# Altium project Driver Input Sensor.PrjPcb
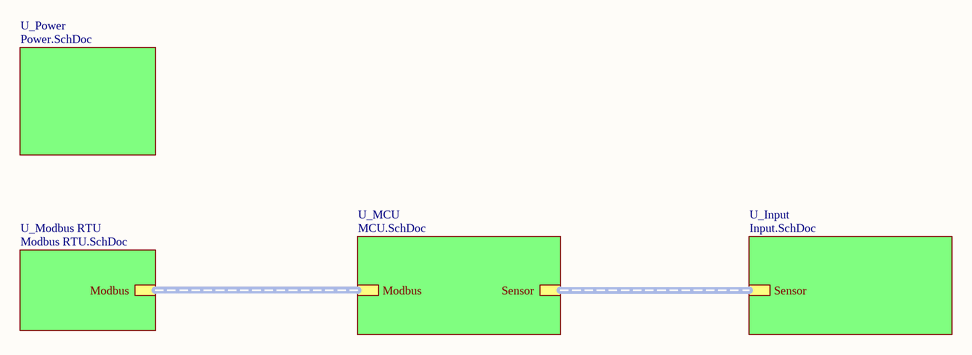
[diagram p0: Diagram.SchDoc]
6 sheets, 98 parts. Net scope: hierarchical (ports join the sheet entries above them; power ports are global).
Board file: Diver Sensor.PcbDoc
Sheets:
  Diagram.SchDoc
    U_Power = Power.SchDoc
    U_Modbus RTU = Modbus RTU.SchDoc
    U_MCU = MCU.SchDoc
    U_Input = Input.SchDoc
      U_Input_Sensor E3J-DS30M2 = Input_Sensor E3J-DS30M2.SchDoc
      U_Input_Sensor E3J-DS30M3 = Input_Sensor E3J-DS30M2.SchDoc
      U_Input_Sensor E3J-DS30M4 = Input_Sensor E3J-DS30M2.SchDoc

## Sheet Diagram.SchDoc
size A4; SheetNumber: 1; SheetTotal: 6

### Sub-sheets
U_Input = Input.SchDoc: Sensor (harness Sensor)
U_MCU = MCU.SchDoc: Modbus (harness Modbus), Sensor (harness Sensor)
U_Modbus RTU = Modbus RTU.SchDoc: Modbus (harness Modbus)
U_Power = Power.SchDoc: no entries

### Buses and harness runs
harness sheet U_Input/Sensor = sheet U_MCU/Sensor
harness sheet U_MCU/Modbus = sheet U_Modbus RTU/Modbus

### Notes on the sheet
- Title
- Size:
- Date:
- A3
- Number:
- Time:
- Revision:
- Sheet
- of
- NICHIETSUVN.COM <http://NICHIETSUVN.COM>
- R&D
- File:

## Sheet Power.SchDoc
size A4; SheetNumber: 2; SheetTotal: 6
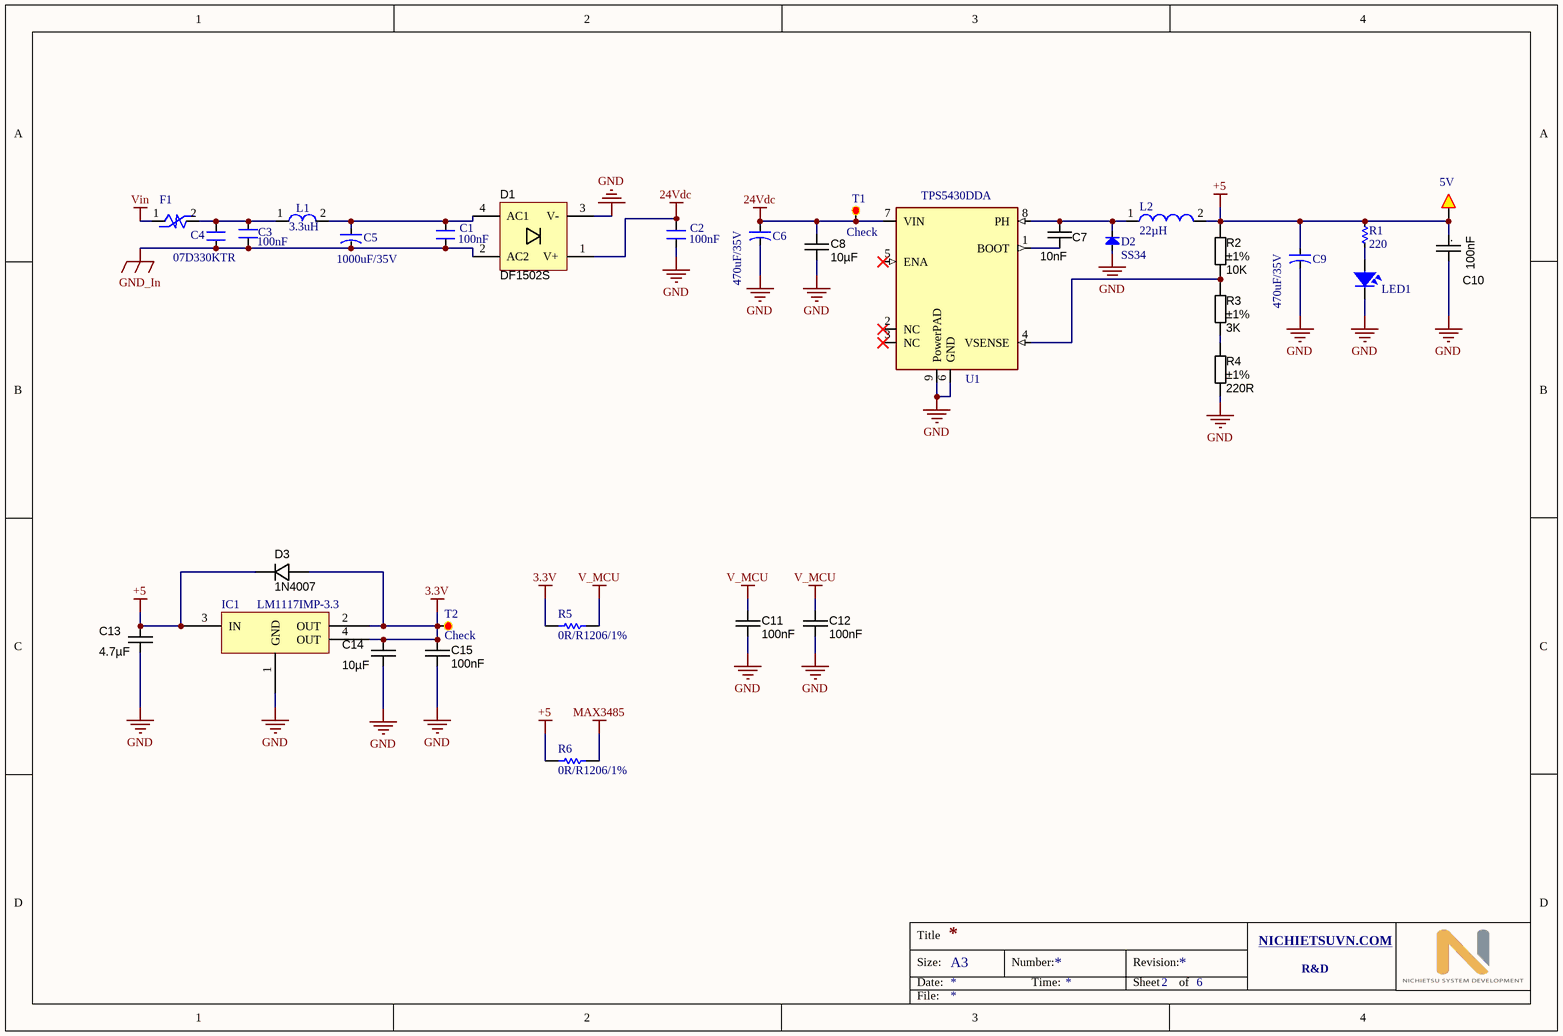
[diagram p1: Power.SchDoc]

### Parts
C1  100nF  [CN-SMD-1206]
C2  100nF  [CN-SMD-1206]
C3  100nF  [CN2.5]
C4  07D330KTR  [CN2-T]
C5  1000uF/35V  [CA-ALU-5L]
C6  470uF/35V  [CA-ALU-6.3]
C7  10nF  [CAPC1608X90N]
C8  10µF  [CAPC2012X135N]
C9  470uF/35V  [CA-ALU-6.3]
C10  100nF  [CAPC2012X135N]
C11  100nF  [CAPC1608X90N]
C12  100nF  [CAPC1608X90N]
C13  4.7µF  [CAPC2012X135N]
C14  10µF  [CAPC2012X135N]
C15  100nF  [CAPC1608X90N]
Check1  5V  [SMD-2]
D1  DF1502S  [DIODE_DF_S]
D2  SS34  [DIO-SMD-106]
D3  1N4007  [DO-214AC]
F1  RUEF185  [RUEF165]  (value not drawn)
IC1  LM1117IMP-3.3  [SOT223]
L1  3.3uH  [L-SMD-M-7.3x4.5]
L2  22µH  [IND_COIL_8D43]
LED1  LED  [LED-0805-Blue]  (value not drawn)
R1  220  [RES-SMD-0603]
R2  value 10K  Tolerance: ±1%  [RESC1608X55N]  (hidden comment: 10K_0603_1%)
R3  value 3K  Tolerance: ±1%  [RESC1608X55N]  (hidden comment: 3K_0603_0.5%)
R4  value 220R  Tolerance: ±1%  [RESC1608X55N]  (hidden comment: 220R_0603_1%)
R5  0R/R1206/1%  [R1206]
R6  0R/R1206/1%  [R1206]
T1  Check  [SMD_1.5]
T2  Check  [SMD_1.5]
U1  TPS5430DDA  [TPS5430]

### Nets
3.3V: C14.2 C15.1 D3.A IC1.2(OUT) IC1.4(OUT) R5.1 T2.1
24Vdc: C2.2 C6.1 C8.2 D1.1(V+) T1.1 U1.7(VIN)
+5: C9.1 C10.1 C13.2 Check1.1 D3.C IC1.3(IN) L2.2 R1.1 R2.2 R6.1
GND: C2.1 C6.2 C8.1 C9.2 C10.2 C11.2 C12.2 C13.1 C14.1 C15.2 D1.3(V-) D2.1(A) IC1.1(GND) LED1.2 R4.1 U1.6(GND) U1.9(PowerPAD)
GND_In: C1.1 C3.1 C4.1 C5.2 D1.2(AC2)
MAX3485: R6.2
V_MCU: C11.1 C12.1 R5.2
Vin: F1.1
NetC1_2: C1.2 C5.1 D1.4(AC1) L1.2
NetC3_2: C3.2 C4.2 F1.2 L1.1
NetC7_1: C7.1 U1.1(BOOT)
NetC7_2: C7.2 D2.2(K) L2.1 U1.8(PH)
NetLED1_1: LED1.1 R1.2
NetR2_1: R2.1 R3.2 U1.4(VSENSE)
NetR3_1: R3.1 R4.2

Not connected (* = marked no-connect by the designer): U1 2(NC)* 3(NC)* 5(ENA)*

### Notes on the sheet
- Title
- Size:
- Date:
- A3
- Number:
- Time:
- Revision:
- Sheet
- of
- NICHIETSUVN.COM <http://NICHIETSUVN.COM>
- R&D
- File:
- (in symbol CAPC_100nF_0805_X7R_50V_10%) .

### Library data of the parts
C1-C4 = CN: Value: 33pF
C5 C6 C9 = CN-ALU-DIP: Capacitor (Semiconductor SIM Model); Value: 104; LatestRevisionDate: 17-Jul-2002; LatestRevisionNote: Re-released for DXP Platform.; PackageReference: C1206; Publisher: Altium Limited
C7 = CAPC_10000pF_0603_50V_10%: 10000pF ±10% 50V Ceramic Capacitor X7R 0603 (1608 Metric); Manufacturer 1: TDK Corporation; Manufacturer Part Number 1: CGA3E2X7R1H103K080AA; Pcs 2: 10; Tolerance: ±10%; Operating Temperature: -55°C ~ 125°C; Package / Case: 0603 (1608 Metric); Voltage - Rated: 50V; Ratings: AEC-Q200; Temperature Coefficient: X7R; Supplier Part Number 1: 445-5662-6-ND; Supplier 1: Digi-Key; Supplier 2: https://www.thegioiic.com; Supplier Part Number 2: https://www.thegioiic.com/products/tu-gom-0603-10nf-50v; Price 2: 1900; Value: 10nF
C8 = CAPC_10uF_0805_X7R_25V_10%: 10µF ±10% 50V Ceramic Capacitor X7R 1206 (3216 Metric); Manufacturer 1: Taiyo Yuden; Manufacturer Part Number: TMK316AB7106KLHT; Voltage - Rated: 25V; Pcs 2: 10; Supplier 1: Digi-Key; Supplier Part Number 1: 587-3485-6-ND; Tolerance: ±10%; Operating Temperature: -55°C ~ 125°C; Package / Case: 0805 (2012 metric); Ratings: AEC-Q200; Temperature Coefficient: X7R; Supplier 2: https://www.thegioiic.com; Supplier Part Number 2: https://www.thegioiic.com/products/tu-gom-0805-10uf-25v; Price 2: 5800; Value: 10µF
C10 = CAPC_100nF_0805_X7R_50V_10%: 0.1µF ±10% 50V Ceramic Capacitor X7R 0805 (2012 Metric); Manufacturer 1: Samsung Electro-Mechanics; Manufacturer Part Number: CL21B104KBFXPJE; Pcs 2: 10; Supplier 1: Digi-Key; Supplier Part Number 1: 1276-CL21B104KBFXPJEDKR-ND; Tolerance: ±10%; Operating Temperature: -55°C ~ 125°C; Package / Case: 0805 (2012 metric); Voltage - Rated: 50V; Ratings: AEC-Q200; Temperature Coefficient: X7R; Price 2: 2000; Supplier 2: https://www.thegioiic.com; Supplier Part Number 2: https://www.thegioiic.com/products/tu-gom-0805-100nf-0-1uf-50v; Value: 100nF
C11 C12 C15 = CAPC_100nF_0603_X7R_50V_10%: 0.1µF ±10% 50V Ceramic Capacitor X7R 0603 (1608 Metric); Manufacturer 1: TDK Corporation; Manufacturer Part Number 1: CGA3E2X7R1H104K080AA; Pcs 2: 10; Supplier 1: Digi-Key; Supplier Part Number 1: 445-5666-6-ND; Tolerance: ±10%; Operating Temperature: -55°C ~ 125°C; Package / Case: 0603 (1608 Metric); Voltage - Rated: 50V; Ratings: AEC-Q200; Temperature Coefficient: X7R; Applications: Automotive; Packaging: Digi-Reel®; Supplier 2: www.thegioiic.com; Supplier Part Number 2: https://www.thegioiic.com/products/tu-gom-0603-100nf-0-1uf-50v; Price 2: 1800; Value: 100nF
C13 C14 = CAPC_4.7uF_0805_X7R_50V_10%: 4.7µF ±10% 50V Ceramic Capacitor X7R 0805 (2012 Metric); Manufacturer 1: TDK Corporation; Manufacturer Part Number: CGA4J1X7R1H475K125AE; Pcs 2: 1; Package / Case: 0805 (2012 metric); Tolerance: ±10%; Voltage - Rated: 50V; Temperature Coefficient: X7R; Ratings: AEC-Q200; Operating Temperature: -55°C ~ 125°C; Supplier 1: Digi-Key; Supplier Part Number 1: 445-181410-6-ND; Supplier 2: https://www.thegioiic.com; Supplier Part Number 2: https://www.thegioiic.com/products/tu-gom-0805-4-7uf-50v; Price 2: 680
  C13: Value: 4.7µF
  C14: Value: 10µF
Check1 T1 T2 = Test: WR-PHD 2.54 mm Angled Socket Header; Manufacturer: W¨¹rth Elektronik eiSos GmbH; partNo: 613002143121; ComponentLink1 Description: Manufacturer; ComponentLink2 Description: Datasheet; NoPins: 02; Created Date: 29 March 2013; ComponentLink1URL: http://www.we-online.com; ComponentLink2URL: http://katalog.we-online.de/em/datasheet/6130xx143121.pdf; Created by: Karrer Zheng
D1 = DIODE_DF1502S: Bridge Rectifier Single Phase Standard 200V Surface Mount DF-S; Manufacturer 1: Diodes Incorporated; Manufacturer Part Number 1: DF1502S-T; Ratings: 200V; 1.5A; Pcs 2: 1; Package / Case: 4-SMD, Gull Wing; Diode Type: Standard; Mounting Type: Surface Mount; Supplier 1: Digi-Key; Supplier Part Number 1: DF1502SDIDKR-ND; Supplier 2: https://www.thegioiic.com; Supplier Part Number 2: https://www.thegioiic.com/products/df1502s-cau-chinh-luu-200v-1-5a; Price 2: 3500
D2 = Diode SMD: Default Diode; Code - JEDEC: DO-214-AB; Value: 1N5007; Published: 8-Jun-2000; Revision: July-2002: Re-released for DXP Platform.; Publisher: Altium Limited
D3 = DIODE_1N4007: Diode  Standard Rectifier SMD 1000V 1A SMA; Manufacturer 1: Micro Commercial Co; Manufacturer Part Number 1: SM4007PL-TP; Speed: Standard Recovery >500ns, > 200mA (Io); Ratings: 1000V; 1A; Pcs 2: 1; Package / Case: DO-214AC, SMA; Diode Type: Standard; Mounting Type: Surface Mount; Supplier 1: Digi-Key; Supplier Part Number 1: SM4007PL-TPMSDKR-ND; Supplier 2: https://www.thegioiic.com; Supplier Part Number 2: https://www.thegioiic.com/products/1n4007-m7-diode-chinh-luu-1a-1kv; Price 2: 1000
IC1 = IC_LM1117IMP-3.3: Linear Voltage Regulator IC  1 Output  800mA SOT-223; Manufacturer: Texas Instruments; Manufacturer Part Number: LM1117IMP-3.3/NOPB; Voltage - Input (Max): 15V; Voltage Dropout (Max): 1.2V @ 800mA; Protection Features: Over Current, Over Temperature; PSRR: 75dB (120Hz); Pcs 2: 1; Supplier 1: Digi-Key; Supplier Part Number 1: LM1117IMP-3.3/NOPBDKR-ND; Current - Output: 800mA; Operating Temperature: -40°C ~ 125°C; Price 2: 11000; Supplier Device Package: SOT-223; Supplier 2: https://www.thegioiic.com; Supplier Part Number 2: https://www.thegioiic.com/products/lm1117imp-3-3-nopb-ic-on-ap-3-3v-800ma
L1 = L-SMD-1: partNo: 78477010; Manufacturer: Wurth Elektronik; Inductance: 1.0 μH; ComponentLink1Description: Manufacturer; ComponentLink1URL: http://www.we-online.de; Created by: Baojun Chen; Created Date: Nov.2015; ComponentLink2Description: Datasheet; ComponentLink2URL: http://katalog.we-online.de/pbs/datasheet/78477010.pdf
L2 = INDC_SMD_22uH_8D43: 22µH Shielded Wirewound Inductor 950mA 380mOhm Max Nonstandard; Manufacturer 1: Yageo; Current Rating (Amps): 3.25 A; Ratings: None AEC-Q200; Pcs 2: 1; Supplier 1: Digi-Key; Operating Temperature: -40°C ~ 125°C; Value: 22µH; Supplier 2: https://www.thegioiic.com/; Supplier Part Number 2: https://www.thegioiic.com/products/cuon-cam-dan-smd-8d43-220-22uh-3-25a; Price 2: 2000
LED1 = LED SMD: Value: LED 3 - 5 ly 2 Colour
R1 = Res-SMD: Resistor; Manufacturer: Generic Components; Class: Passive; Published: 08/06/2000; Publisher: Altium Hobart Technology Centre
R2 = RES_10K_0603_1%: 10 kOhms ±1% 0.1W, 1/10W Chip Resistor 0603 (1608 Metric) Anti-Sulfur, Automotive AEC-Q200, Moisture Resistant Thin Film; Manufacturer: Stackpole Electronics Inc; Manufacturer Part Number: RMCF0603FT10K0; Temperature Coefficient: ±100ppm/°C; Pcs 2: 50; Package / Case: 0603 (1608 Metric); Power (Watts): 1/10W; Supplier 1: Digi-Key; Supplier Part Number 1: RMCF0603FT10K0DKR-ND; Ratings: Automotive AEC-Q200; Operating Temperature: -55°C ~ 155°C; Supplier 2: www.thegioiic.com; Supplier Part Number 2: https://www.thegioiic.com/products/dien-tro-10-kohm-0603-1; Price 2: 2000
R3 = RES_3K_0603_1%: 3 kOhms ±1% 0.1W, 1/10W Chip Resistor 0603 (1608 Metric) Automotive AEC-Q200 Thick Film; Manufacturer: Stackpole Electronics Inc; Manufacturer Part Number: RMCF0603FT3K00; Temperature Coefficient: ±100ppm/°C; Pcs 2: 50; Package / Case: 0603 (1608 Metric); Power (Watts): 1/10W; Supplier 1: Digi-Key; Supplier Part Number 1: RMCF0603FT3K00DKR-ND; Ratings: AEC-Q200; Supplier Part Number 2: https://www.thegioiic.com/products/dien-tro-3-kohm-0603-1; Supplier 2: www.thegioiic.com; Operating Temperature: -55°C ~ 155°C; Price 2: 2000
R4 = RES_220R_0603_1%: 220 Ohms ±1% 0.1W, 1/10W Chip Resistor 0603 (1608 Metric) Automotive AEC-Q200 Thick Film; Manufacturer: Stackpole Electronics Inc; Manufacturer Part Number: RMCF0603FT220R; Temperature Coefficient: ±100ppm/°C; Pcs 2: 50; Package / Case: 0603 (1608 Metric); Ratings: AEC-Q200; Supplier 1: Digi-Key; Supplier Part Number 1: RMCF0603FT220RDKR-ND; Power (Watts): 0.1W, 1/10W; Operating Temperature: -55°C ~ 155°C; Composition: Thick Film; Supplier 2: www.thegioiic.com; Supplier Part Number 2: https://www.thegioiic.com/products/dien-tro-220-ohm-0603-1; Price 2: 2000
R5 R6 = RES_0R/R1206/1%: RES SMD 0.0 OHM JUMPER 1/4W 1206; Manufacturer: Bourns Inc.; Manufacturer Part Number: CR1206-J/-000ELF; Resistance (Ohms): 0.0; Power (Watts): 0.25W, 1/4W; Temperature Coefficient: -250/ +500ppm/°C; Supplier 1: Digi-Key; RoHS: RoHS Compliant By Exemption; Category: Resistors; Stock 1: 80000; Pricing 1: 5000=0.00931, 10000=0.00809, 25000=0.00711, 50000=0.00652, 125000=0.00638 (USD); Packaging: Tape & Reel (TR); Tolerance: Jumper; Composition: Thick Film; Features: Moisture Resistant; Operating Temperature: -55°C ~ 155°C; Package / Case: 1206 (3216 Metric); Supplier Device Package: 1206; Size / Dimension: 0.126" L x 0.063" W (3.20mm x 1.60mm); Height: 0.030" (0.75mm); Number of Terminations: 2; ComponentLink1URL: http://www.bourns.com/data/global/pdfs/CHPREZTR.pdf; ComponentLink1Description: http://www.bourns.com/data/global/pdfs/CHPREZTR.pdf; Supplier Part Number 1: CR1206-J/-000ELFTR-ND

## Sheet Modbus RTU.SchDoc
size A4; SheetNumber: 6; SheetTotal: 6
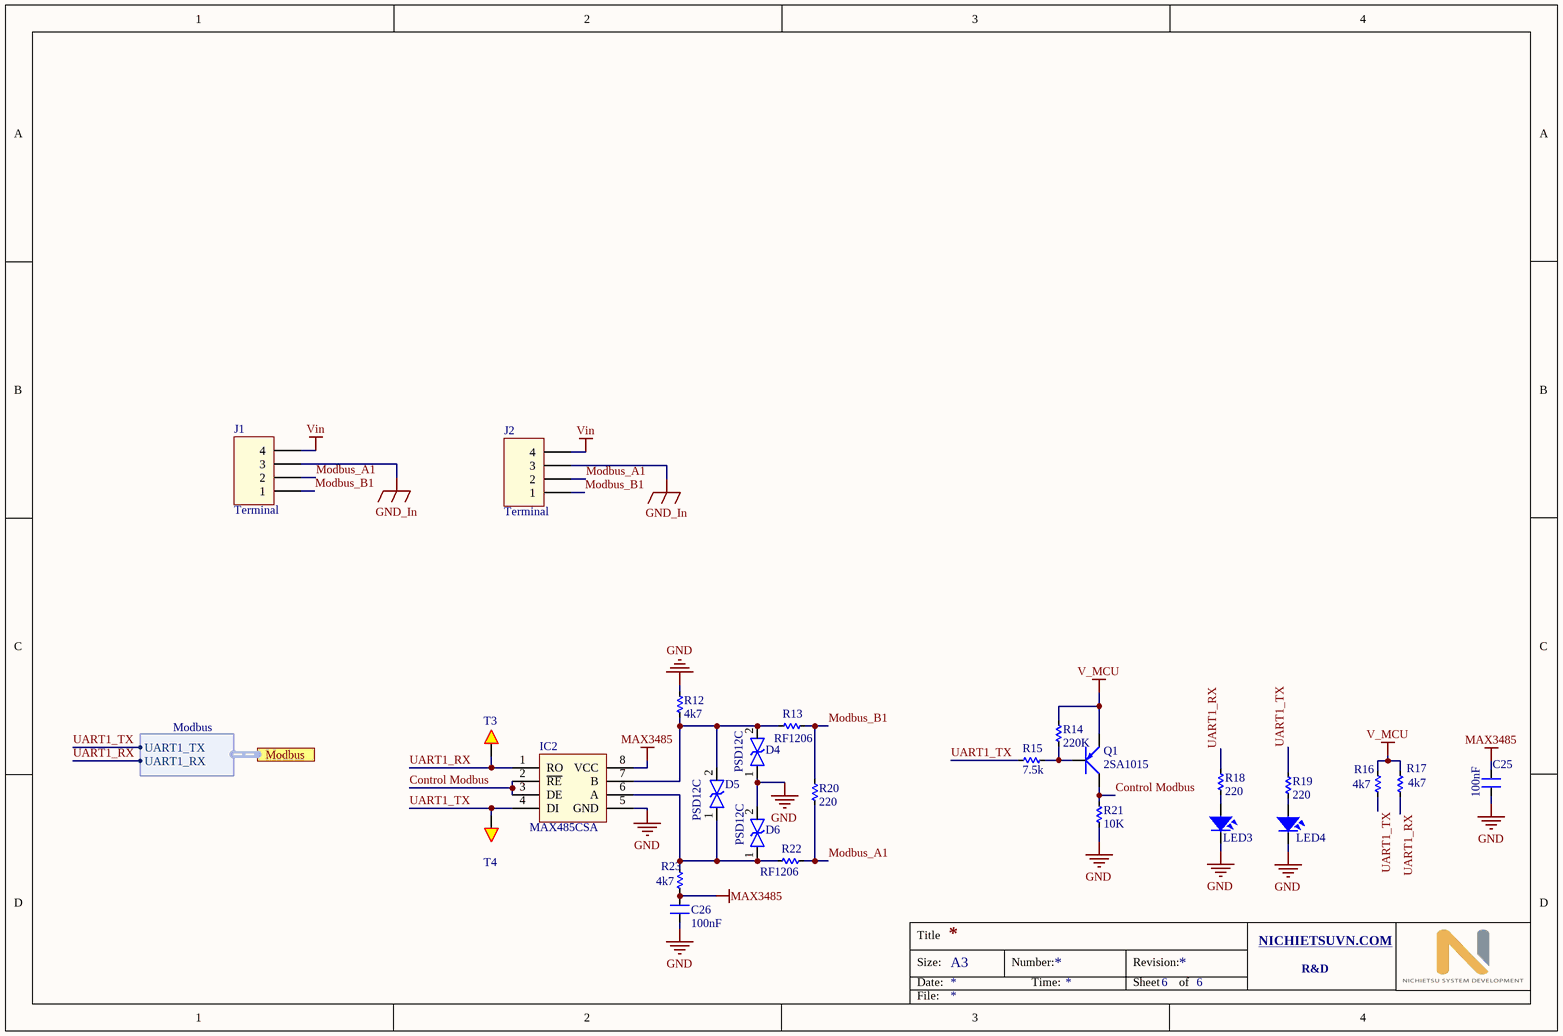
[diagram p2: Modbus RTU.SchDoc]

### Parts
C25  100nF  [CN-SMD-0603]
C26  100nF  [CN-SMD-0603]
D4  PSD12C  [PSD12C]
D5  PSD12C  [PSD12C]
D6  PSD12C  [PSD12C]
IC2  MAX485CSA  [SO8]
J1  Terminal  [691305340004]
J2  Terminal  [691305340004]
LED3  LED  [LED-0805-Blue]  (value not drawn)
LED4  LED  [LED-0805-Blue]  (value not drawn)
Q1  2SA1015  [SOT23-321]
R12  4k7  [RES-SMD-0603]
R13  RF1206  [RES-SMD-1206]
R14  220K  [RES-SMD-0603]
R15  7.5k  [RES-SMD-0603]
R16  4k7  [RES-SMD-0603]
R17  4k7  [RES-SMD-0603]
R18  220  [RES-SMD-0603]
R19  220  [RES-SMD-0603]
R20  220  [RES-SMD-0603]
R21  10K  [RES-SMD-0603]
R22  RF1206  [RES-SMD-1206]
R23  4k7  [RES-SMD-0603]
T3  Test  [Test]  (value not drawn)
T4  Test  [Test]  (value not drawn)

### Ports
Modbus (harness Modbus)

### Harnesses
Modbus: UART1_TX, UART1_RX

### Nets
GND: C25.1 C26.2 D4.1 D6.2 IC2.5(GND) LED3.2 LED4.2 R12.1 R21.1
GND_In: J1.3 J2.3
MAX3485: C25.2 C26.1 IC2.8(VCC) R23.1
V_MCU: Q1.1(E) R14.2 R16.1 R17.1
Vin: J1.4 J2.4
Control Modbus: IC2.2(~{RE}) IC2.3(DE) Q1.2(C) R21.2
Modbus_A1: J1.2 J2.2 R20.2 R22.1
Modbus_B1: J1.1 J2.1 R13.1 R20.1
UART1_RX: IC2.1(RO) R17.2 R18.1 T3.1 ; port Modbus.UART1_RX
UART1_TX: IC2.4(DI) R15.1 R16.2 R19.1 T4.1 ; port Modbus.UART1_TX
NetD4_2: D4.2 D5.2 IC2.7(B) R12.2 R13.2
NetD5_1: D5.1 D6.1 IC2.6(A) R22.2 R23.2
NetLED3_1: LED3.1 R18.2
NetLED4_1: LED4.1 R19.2
NetQ1_3: Q1.3(B) R14.1 R15.2

### Notes on the sheet
- Title
- Size:
- Date:
- A3
- Number:
- Time:
- Revision:
- Sheet
- of
- NICHIETSUVN.COM <http://NICHIETSUVN.COM>
- R&D
- File:

### Library data of the parts
C25 C26 = CN: Value: 33pF
D4-D6 = PSD12C: diode tvs
IC2 = MAX485: RS232 - RS485 (Same sn75176)
J1 J2 = 691305340004: WR-TBL Serie 3053 - 3.81 mm Horizontal PCB Header with Plastic Latch, 04p; Pitch: 3.81 mm; Published Date: Jan 2017; Publisher: Wurth Elektronik; ComponentLink1Description: Manufacturer; ComponentLink1URL: http://www.we-online.de; ComponentLink2Description: Datasheet; ComponentLink2URL: http://katalog.we-online.de/em/datasheet/691305340004.pdf; Part Number: 691305340004; Pin Number: 04p
LED3 LED4 = LED SMD: Value: LED 3 - 5 ly 2 Colour
Q1 = 2SA1015: PNP 600mW, ECB; Value: A1015
R12-R23 = Res-SMD: as R1 on sheet Power; Published: 08/06/2000; Publisher: Altium Hobart Technology Centre
T3 T4 = Test: as Check1 on sheet Power; Created Date: 29 March 2013; ComponentLink1URL: http://www.we-online.com; ComponentLink2URL: http://katalog.we-online.de/em/datasheet/6130xx143121.pdf; Created by: Karrer Zheng

## Sheet MCU.SchDoc
size A4; SheetNumber: 5; SheetTotal: 6
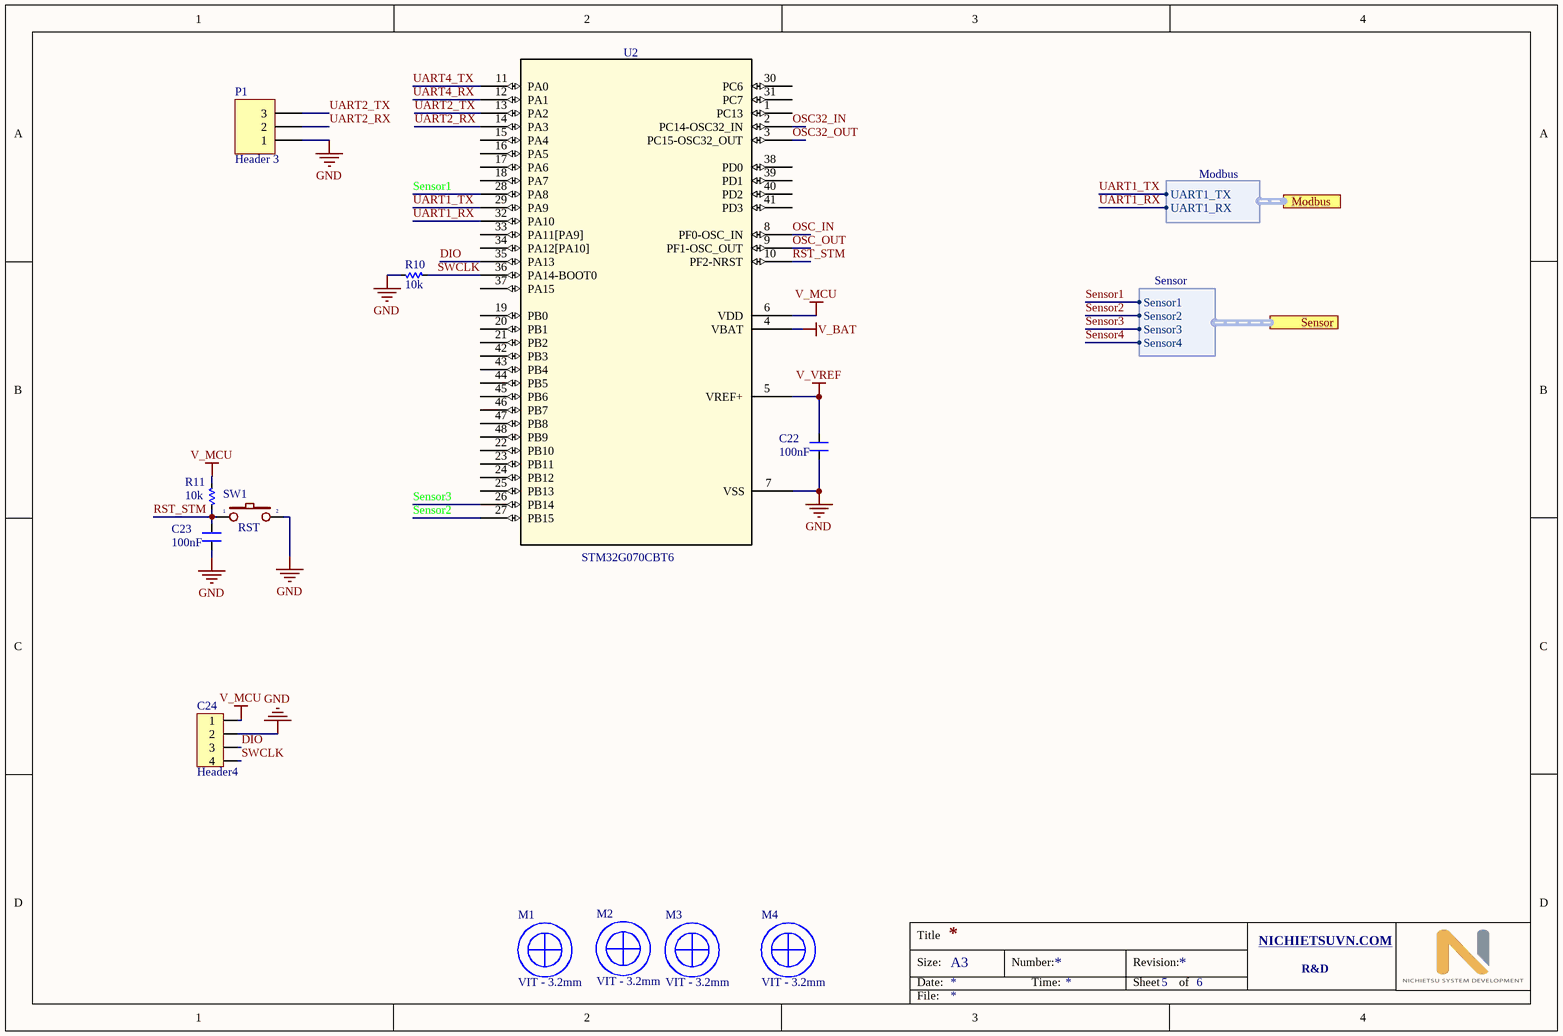
[diagram p3: MCU.SchDoc]

### Parts
C22  100nF  [CN-SMD-0603]
C23  100nF  [CN-SMD-0603]
C24  Header4  [Header4]
M1  VIT - 3.2mm  [VIT - 3.2MM_2]
M2  VIT - 3.2mm  [VIT - 3.2MM_2]
M3  VIT - 3.2mm  [VIT - 3.2MM_2]
M4  VIT - 3.2mm  [VIT - 3.2MM_2]
P1  Header 3  [Header 3]
R10  10k  [RES-SMD-0603]
R11  10k  [RES-SMD-0603]
SW1  RST  [SW1-SMD]
U2  STM32G070CBT6  [STM32G070CBT6]

### Ports
Modbus (harness Modbus), Sensor (harness Sensor)

### Harnesses
Modbus: UART1_TX, UART1_RX
Sensor: Sensor1, Sensor2, Sensor3, Sensor4

### Nets
GND: C22.2 C23.2 C24.2 P1.1 R10.2 SW1.2 U2.7(VSS)
V_BAT: U2.4(VBAT)
V_MCU: C24.1 R11.1 U2.6(VDD)
V_VREF: C22.1 U2.5(VREF+)
DIO: C24.3 U2.35(PA13)
OSC32_IN: U2.2(PC14-OSC32_IN)
OSC32_OUT: U2.3(PC15-OSC32_OUT)
OSC_IN: U2.8(PF0-OSC_IN)
OSC_OUT: U2.9(PF1-OSC_OUT)
RST_STM: C23.1 R11.2 SW1.1 U2.10(PF2-NRST)
Sensor1: U2.28(PA8) ; port Sensor.Sensor1  [project net OPTO_OUT]
Sensor2: U2.27(PB15) ; port Sensor.Sensor2  [project net OPTO_OUT]
Sensor3: U2.26(PB14) ; port Sensor.Sensor3  [project net OPTO_OUT]
Sensor4: port Sensor.Sensor4
SWCLK: C24.4 R10.1 U2.36(PA14-BOOT0)
UART1_RX: U2.32(PA10) ; port Modbus.UART1_RX
UART1_TX: U2.29(PA9) ; port Modbus.UART1_TX
UART2_RX: P1.2 U2.14(PA3)
UART2_TX: P1.3 U2.13(PA2)
UART4_RX: U2.12(PA1)
UART4_TX: U2.11(PA0)

Not connected (* = marked no-connect by the designer): U2 1(PC13) 15(PA4) 16(PA5) 17(PA6) 18(PA7) 19(PB0) 20(PB1) 21(PB2) 22(PB10) 23(PB11) 24(PB12) 25(PB13) 30(PC6) 31(PC7) 33(PA11[PA9]) 34(PA12[PA10]) 37(PA15) 38(PD0) 39(PD1) 40(PD2) 41(PD3) 42(PB3) 43(PB4) 44(PB5) 45(PB6) 46(PB7) 47(PB8) 48(PB9)

### Notes on the sheet
- Title
- Size:
- Date:
- A3
- Number:
- Time:
- Revision:
- Sheet
- of
- NICHIETSUVN.COM <http://NICHIETSUVN.COM>
- R&D
- File:

### Library data of the parts
C22 C23 = CN: Value: 33pF
C24 = Header4: Header IDC, 4 x 1 Pin Vertical 2.54mm Pitch (Non-Boxed, Male); Manufacturer: W¨¹rth Elektronik eiSos GmbH; partNo: 613002143121; ComponentLink1 Description: Manufacturer; ComponentLink2 Description: Datasheet; NoPins: 02; Created Date: 29 March 2013; ComponentLink1URL: http://www.we-online.com; ComponentLink2URL: http://katalog.we-online.de/em/datasheet/6130xx143121.pdf; Created by: Karrer Zheng
M1-M4 = VIT - 3.2mm_1
P1 = Header 3: Header, 3-Pin; LatestRevisionDate: 17-Jul-2002; LatestRevisionNote: Re-released for DXP Platform.; Publisher: Altium Limited
R10 R11 = Res-SMD: as R1 on sheet Power; Published: 08/06/2000; Publisher: Altium Hobart Technology Centre
SW1 = SW2: Switch button 2 pin; Value: SW chip 2 pin
U2 = STM32G070CBT6: No Description Available; Vendor: STMicroelectronics; Built_By: EMA_UL_Team; SourceLibrary: Updates_to_database_2020-10-19; Manufacturer_Part_Number: STM32G070CBT6; Copyright: Copyright (C) 2018 Accelerated Designs. All rights reserved; RefDes: RefDes; Type: DEV

## Sheet Input.SchDoc
size A4; SheetNumber: 3; SheetTotal: 6
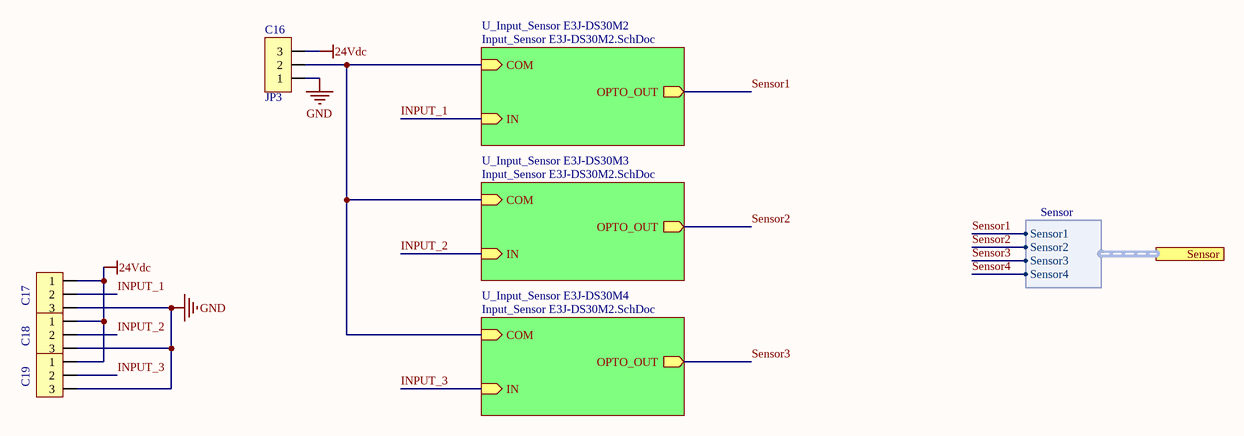
[diagram p4: Input.SchDoc]

### Parts
C16  JP3  [JP3-CLOSED]
C17  Header3  [Header3 90]  (value not drawn)
C18  Header3  [Header3 90]  (value not drawn)
C19  Header3  [Header3 90]  (value not drawn)

### Sub-sheets
U_Input_Sensor E3J-DS30M2 = Input_Sensor E3J-DS30M2.SchDoc: COM (in), IN (in), OPTO_OUT (out)
U_Input_Sensor E3J-DS30M3 = Input_Sensor E3J-DS30M2.SchDoc: COM (in), IN (in), OPTO_OUT (out)
U_Input_Sensor E3J-DS30M4 = Input_Sensor E3J-DS30M2.SchDoc: COM (in), IN (in), OPTO_OUT (out)

### Ports
Sensor (harness Sensor)

### Harnesses
Sensor: Sensor1, Sensor2, Sensor3, Sensor4

### Nets
24Vdc: C16.3 C17.1 C18.1 C19.1
GND: C16.1 C17.3 C18.3 C19.3
INPUT_1: C17.2 ; sheet U_Input_Sensor E3J-DS30M2/IN
INPUT_2: C18.2 ; sheet U_Input_Sensor E3J-DS30M3/IN
INPUT_3: C19.2 ; sheet U_Input_Sensor E3J-DS30M4/IN
Sensor1: sheet U_Input_Sensor E3J-DS30M2/OPTO_OUT, port Sensor.Sensor1  [project net OPTO_OUT]
Sensor2: sheet U_Input_Sensor E3J-DS30M3/OPTO_OUT, port Sensor.Sensor2  [project net OPTO_OUT]
Sensor3: sheet U_Input_Sensor E3J-DS30M4/OPTO_OUT, port Sensor.Sensor3  [project net OPTO_OUT]
Sensor4: port Sensor.Sensor4
NetC16_2: C16.2 ; sheet U_Input_Sensor E3J-DS30M2/COM, sheet U_Input_Sensor E3J-DS30M3/COM, sheet U_Input_Sensor E3J-DS30M4/COM

### Notes on the sheet
- Title
- Size:
- Date:
- A3
- Number:
- Time:
- Revision:
- Sheet
- of
- NICHIETSUVN.COM <http://NICHIETSUVN.COM>
- R&D
- File:

### Library data of the parts
C16 = JP3: WR-PHD 2.54 mm Angled Socket Header; Manufacturer: W¨¹rth Elektronik eiSos GmbH; partNo: 613003143121; ComponentLink1 Description: Manufacturer; ComponentLink2 Description: Datasheet; NoPins: 03; Created Date: 29 March 2013; ComponentLink1URL: http://www.we-online.com; ComponentLink2URL: http://katalog.we-online.de/em/datasheet/6130xx143121.pdf; Created by: Karrer Zheng
C17-C19 = Header3: Header IDC, 3 x 1 Pin Vertical 2.54mm Pitch (Non-Boxed, Male); Manufacturer: W¨¹rth Elektronik eiSos GmbH; partNo: 613002143121; ComponentLink1 Description: Manufacturer; ComponentLink2 Description: Datasheet; NoPins: 02; Created Date: 29 March 2013; ComponentLink1URL: http://www.we-online.com; ComponentLink2URL: http://katalog.we-online.de/em/datasheet/6130xx143121.pdf; Created by: Karrer Zheng

## Sheet Input_Sensor E3J-DS30M2.SchDoc
size A4; SheetNumber: 4; SheetTotal: 6
Used 3 times, as channels U_Input/U_Input_Sensor E3J-DS30M2, U_Input/U_Input_Sensor E3J-DS30M3, U_Input/U_Input_Sensor E3J-DS30M4. Parts and nets are listed once, with the designators drawn on the sheet.
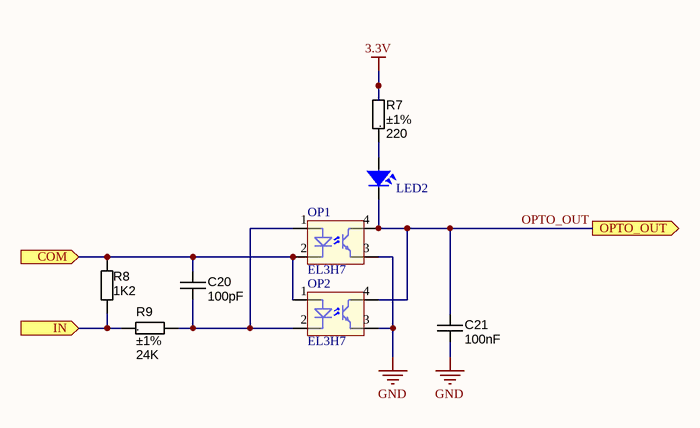
[diagram p5: Input_Sensor E3J-DS30M2.SchDoc]

### Parts
C20  100pF  [CAPC1608X90N]
C21  100nF  [CAPC1608X90N]
LED2  LED  [LED-0805-Green]  (value not drawn)
OP1  EL3H7  [IC_SMD_SSOP4_NEW]
OP2  EL3H7  [IC_SMD_SSOP4_NEW]
R7  value 220  Tolerance: ±1%  [RESC1608X55N]  (hidden comment: 10K_0603_1%)
R8  value 1K2  [RES_2W_AXIAL_11x4_STAND]  (hidden comment: Metal Film)
R9  value 24K  Tolerance: ±1%  [RESC2012X70N]  (hidden comment: 24K_0805_1%)

### Ports
COM (in), IN (in), OPTO_OUT (out)

### Nets
3.3V: R7.2
GND: C21.2 OP1.3(E) OP2.3(E)
COM: C20.1 OP1.2(K) OP2.1(A) R8.1 ; port COM
IN: R8.2 R9.1 ; port IN
OPTO_OUT: C21.1 LED2.2 OP1.4(C) OP2.4(C) ; port OPTO_OUT
NetC20_2: C20.2 OP1.1(A) OP2.2(K) R9.2
NetLED2_1: LED2.1 R7.1

### Channels
U_Input/U_Input_Sensor E3J-DS30M2: designators end in _U_Input_Sensor_E3J-DS30M2; ports COM=NetC16_2 IN=INPUT_1 OPTO_OUT=OPTO_OUT
U_Input/U_Input_Sensor E3J-DS30M3: designators end in _U_Input_Sensor_E3J-DS30M3; ports COM=NetC16_2 IN=INPUT_2 OPTO_OUT=OPTO_OUT
U_Input/U_Input_Sensor E3J-DS30M4: designators end in _U_Input_Sensor_E3J-DS30M4; ports COM=NetC16_2 IN=INPUT_3 OPTO_OUT=OPTO_OUT

### Notes on the sheet
- Title
- Size:
- Date:
- A3
- Number:
- Time:
- Revision:
- Sheet
- of
- NICHIETSUVN.COM <http://NICHIETSUVN.COM>
- R&D
- File:
- (in symbol RES_10K_0603_1%) .
- (in symbol RES_24K_0805_1%) .

### Library data of the parts
C20 = CAPC_100pF_0603_C0G_NP0_100V_5%: 100pF ±5% 100V Ceramic Capacitor C0G, NP0 0603 (1608 Metric); Manufacturer 1: TDK Corporation; Pcs 2: 10; Tolerance: ±5%; Operating Temperature: -55°C ~ 125°C; Package / Case: 0603 (1608 Metric); Voltage - Rated: 100V; Temperature Coefficient: C0G, NP0; Ratings: AEC-Q200; Applications: Automotive; Packaging: Digi-Reel®; Supplier 1: Digi-Key; Supplier Part Number 1: 445-5724-6-ND; Value: 100pF; Supplier 2: https://www.thegioiic.com; Supplier Part Number 2: https://www.thegioiic.com/products/tu-gom-0603-100pf-50v; Price 2: 1800
C21 = CAPC_100nF_0603_X7R_50V_10%: as C11 on sheet Power; Supplier 1: Digi-Key; Supplier Part Number 1: 445-5666-6-ND; Tolerance: ±10%; Operating Temperature: -55°C ~ 125°C; Package / Case: 0603 (1608 Metric); Voltage - Rated: 50V; Ratings: AEC-Q200; Temperature Coefficient: X7R; Applications: Automotive; Packaging: Digi-Reel®; Supplier 2: www.thegioiic.com; Supplier Part Number 2: https://www.thegioiic.com/products/tu-gom-0603-100nf-0-1uf-50v; Price 2: 1800; Value: 100nF
LED2 = LED SMD: Value: LED 3 - 5 ly 2 Colour
OP1 OP2 = OPTO_EL3H7: Photo Transistor; Manufacturer Part Number 1: EL3H7(TA)-VG; Manufacturer 1: Everlight Electronics Co Ltd; Pcs 2: 1; Operating Temperature: -55°C ~ 110°C; Supplier 1: Digi-Key; Supplier Part Number 1: 1080-1198-6-ND; Supplier 2: linhkien.cxt.vn; Supplier Part Number 2: https://linhkien.cxt.vn/2637-el3h7bta-vg.html; Price 2: 1100
R7 = RES_10K_0603_1%: as R2 on sheet Power; Package / Case: 0603 (1608 Metric); Power (Watts): 1/10W; Supplier 1: Digi-Key; Supplier Part Number 1: RMCF0603FT10K0DKR-ND; Ratings: Automotive AEC-Q200; Operating Temperature: -55°C ~ 155°C; Supplier 2: www.thegioiic.com; Supplier Part Number 2: https://www.thegioiic.com/products/dien-tro-10-kohm-0603-1; Price 2: 2000
R8 = RES_390R_Axial_2W_5%: Resistor THD 390 Ohm 2W 5% Metal Film; Manufacturer 1: Yageo; Manufacturer Part Number 1: FMP200JR-52-390R; Pcs 2: 1; Tolerance: ±5%; Size / Dimension: 0.154" Dia x 0.354" L (3.90mm x 9.00mm); Power (Watts): 2W; Supplier 2: https://www.thegioiic.com; Supplier Part Number 2: https://www.thegioiic.com/products/dien-tro-390-ohm-2w-5-4-vong-mau; Price 2: 500; Supplier 1: Digi-Key; Supplier Part Number 1: 390ZTR-ND
R9 = RES_24K_0805_1%: 24 kOhms ±1% 0.125W, 1/8W Chip Resistor 0805 (2012 Metric) Automotive AEC-Q200 Thick Film; Manufacturer: Stackpole Electronics Inc; Manufacturer Part Number: RMCF0805FT10K5; Power (Watts): 0.1W, 1/10W; Temperature Coefficient: ±100ppm/°C; Pcs 2: 50; Package / Case: 0805 (2012 Metric); Features: Automotive AEC-Q200; Supplier 1: Digi-Key; Supplier Part Number 1: RMCF0805FT24K0DKR-ND; Operating Temperature: -55°C ~ 155°C; Supplier 2: www.thegioiic.com; Supplier Part Number 2: https://www.thegioiic.com/products/dien-tro-24-kohm-0805-5; Price 2: 1800

## Nets that join several sheets
3.3V: Power (7 pins), U_Input/U_Input_Sensor E3J-DS30M2 (R7_U_Input_Sensor_E3J-DS30M2.2), U_Input/U_Input_Sensor E3J-DS30M3 (R7_U_Input_Sensor_E3J-DS30M3.2), U_Input/U_Input_Sensor E3J-DS30M4 (R7_U_Input_Sensor_E3J-DS30M4.2)
24Vdc: Power (6 pins), Input (C16.3 C17.1 C18.1 C19.1)
GND: Power (17 pins), Modbus RTU (9 pins), MCU (7 pins), Input (C16.1 C17.3 C18.3 C19.3), U_Input/U_Input_Sensor E3J-DS30M2 (C21_U_Input_Sensor_E3J-DS30M2.2 OP1_U_Input_Sensor_E3J-DS30M2.3 OP2_U_Input_Sensor_E3J-DS30M2.3), U_Input/U_Input_Sensor E3J-DS30M3 (C21_U_Input_Sensor_E3J-DS30M3.2 OP1_U_Input_Sensor_E3J-DS30M3.3 OP2_U_Input_Sensor_E3J-DS30M3.3), U_Input/U_Input_Sensor E3J-DS30M4 (C21_U_Input_Sensor_E3J-DS30M4.2 OP1_U_Input_Sensor_E3J-DS30M4.3 OP2_U_Input_Sensor_E3J-DS30M4.3)
GND_In: Power (5 pins), Modbus RTU (J1.3 J2.3)
MAX3485: Power (R6.2), Modbus RTU (C25.2 C26.1 IC2.8 R23.1)
V_MCU: Power (C11.1 C12.1 R5.2), Modbus RTU (Q1.1 R14.2 R16.1 R17.1), MCU (C24.1 R11.1 U2.6)
Vin: Power (F1.1), Modbus RTU (J1.4 J2.4)
INPUT_1: Input (C17.2), U_Input/U_Input_Sensor E3J-DS30M2 (R8_U_Input_Sensor_E3J-DS30M2.2 R9_U_Input_Sensor_E3J-DS30M2.1)
INPUT_2: Input (C18.2), U_Input/U_Input_Sensor E3J-DS30M3 (R8_U_Input_Sensor_E3J-DS30M3.2 R9_U_Input_Sensor_E3J-DS30M3.1)
INPUT_3: Input (C19.2), U_Input/U_Input_Sensor E3J-DS30M4 (R8_U_Input_Sensor_E3J-DS30M4.2 R9_U_Input_Sensor_E3J-DS30M4.1)
NetC16_2: Input (C16.2), U_Input/U_Input_Sensor E3J-DS30M2 (C20_U_Input_Sensor_E3J-DS30M2.1 OP1_U_Input_Sensor_E3J-DS30M2.2 OP2_U_Input_Sensor_E3J-DS30M2.1 R8_U_Input_Sensor_E3J-DS30M2.1), U_Input/U_Input_Sensor E3J-DS30M3 (C20_U_Input_Sensor_E3J-DS30M3.1 OP1_U_Input_Sensor_E3J-DS30M3.2 OP2_U_Input_Sensor_E3J-DS30M3.1 R8_U_Input_Sensor_E3J-DS30M3.1), U_Input/U_Input_Sensor E3J-DS30M4 (C20_U_Input_Sensor_E3J-DS30M4.1 OP1_U_Input_Sensor_E3J-DS30M4.2 OP2_U_Input_Sensor_E3J-DS30M4.1 R8_U_Input_Sensor_E3J-DS30M4.1)
OPTO_OUT: MCU (U2.28), U_Input/U_Input_Sensor E3J-DS30M2 (C21_U_Input_Sensor_E3J-DS30M2.1 LED2_U_Input_Sensor_E3J-DS30M2.2 OP1_U_Input_Sensor_E3J-DS30M2.4 OP2_U_Input_Sensor_E3J-DS30M2.4)
OPTO_OUT: MCU (U2.26), U_Input/U_Input_Sensor E3J-DS30M4 (C21_U_Input_Sensor_E3J-DS30M4.1 LED2_U_Input_Sensor_E3J-DS30M4.2 OP1_U_Input_Sensor_E3J-DS30M4.4 OP2_U_Input_Sensor_E3J-DS30M4.4)
OPTO_OUT: MCU (U2.27), U_Input/U_Input_Sensor E3J-DS30M3 (C21_U_Input_Sensor_E3J-DS30M3.1 LED2_U_Input_Sensor_E3J-DS30M3.2 OP1_U_Input_Sensor_E3J-DS30M3.4 OP2_U_Input_Sensor_E3J-DS30M3.4)
UART1_RX: Modbus RTU (IC2.1 R17.2 R18.1 T3.1), MCU (U2.32)
UART1_TX: Modbus RTU (5 pins), MCU (U2.29)